# EAGLE design XMICRO-EXT (EAGLE 6.3)
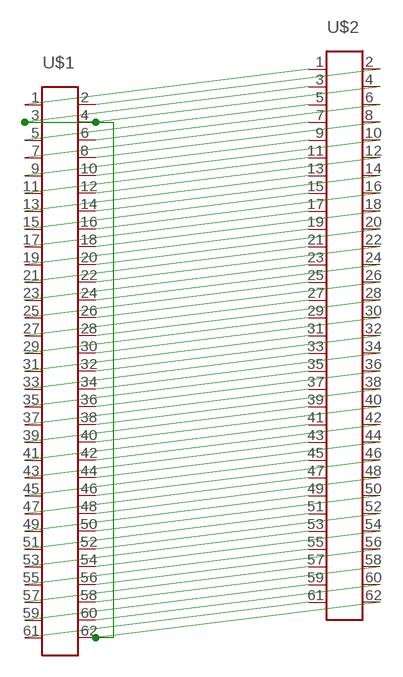
[diagram p0: schematic, sheet 1]

## Parts
U$1  EDGE62M  [EDGE62M]
U$2  EDGE62FR  [EDGE62FR]

## Nets
GND [GND]: U$1.3 U$1.4 U$1.62 U$2.3 U$2.4 U$2.62
N$1: U$1.1 U$2.1
N$2: U$1.2 U$2.2
N$5: U$1.5 U$2.5
N$6: U$1.6 U$2.6
N$7: U$1.7 U$2.7
N$8: U$1.8 U$2.8
N$9: U$1.9 U$2.9
N$10: U$1.10 U$2.10
N$11: U$1.11 U$2.11
N$12: U$1.12 U$2.12
N$13: U$1.13 U$2.13
N$14: U$1.14 U$2.14
N$15: U$1.15 U$2.15
N$16: U$1.16 U$2.16
N$17: U$1.17 U$2.17
N$18: U$1.18 U$2.18
N$19: U$1.19 U$2.19
N$20: U$1.20 U$2.20
N$21: U$1.21 U$2.21
N$22: U$1.22 U$2.22
N$23: U$1.23 U$2.23
N$24: U$1.24 U$2.24
N$25: U$1.25 U$2.25
N$26: U$1.26 U$2.26
N$27: U$1.27 U$2.27
N$28: U$1.28 U$2.28
N$29: U$1.29 U$2.29
N$30: U$1.30 U$2.30
N$31: U$1.31 U$2.31
N$32: U$1.32 U$2.32
N$33: U$1.33 U$2.33
N$34: U$1.34 U$2.34
N$35: U$1.35 U$2.35
N$36: U$1.36 U$2.36
N$37: U$1.37 U$2.37
N$38: U$1.38 U$2.38
N$39: U$1.39 U$2.39
N$40: U$1.40 U$2.40
N$41: U$1.41 U$2.41
N$42: U$1.42 U$2.42
N$43: U$1.43 U$2.43
N$44: U$1.44 U$2.44
N$45: U$1.45 U$2.45
N$46: U$1.46 U$2.46
N$47: U$1.47 U$2.47
N$48: U$1.48 U$2.48
N$49: U$1.49 U$2.49
N$50: U$1.50 U$2.50
N$51: U$1.51 U$2.51
N$52: U$1.52 U$2.52
N$53: U$1.53 U$2.53
N$54: U$1.54 U$2.54
N$55: U$1.55 U$2.55
N$56: U$1.56 U$2.56
N$57: U$1.57 U$2.57
N$58: U$1.58 U$2.58
N$59: U$1.59 U$2.59
N$60: U$1.60 U$2.60
N$61: U$1.61 U$2.61

## Library data of the parts
U$1 U$2 = Custom:EDGE62

## Net classes
1 GND: width 0.254 mm, clearance 0.508 mm

## Board
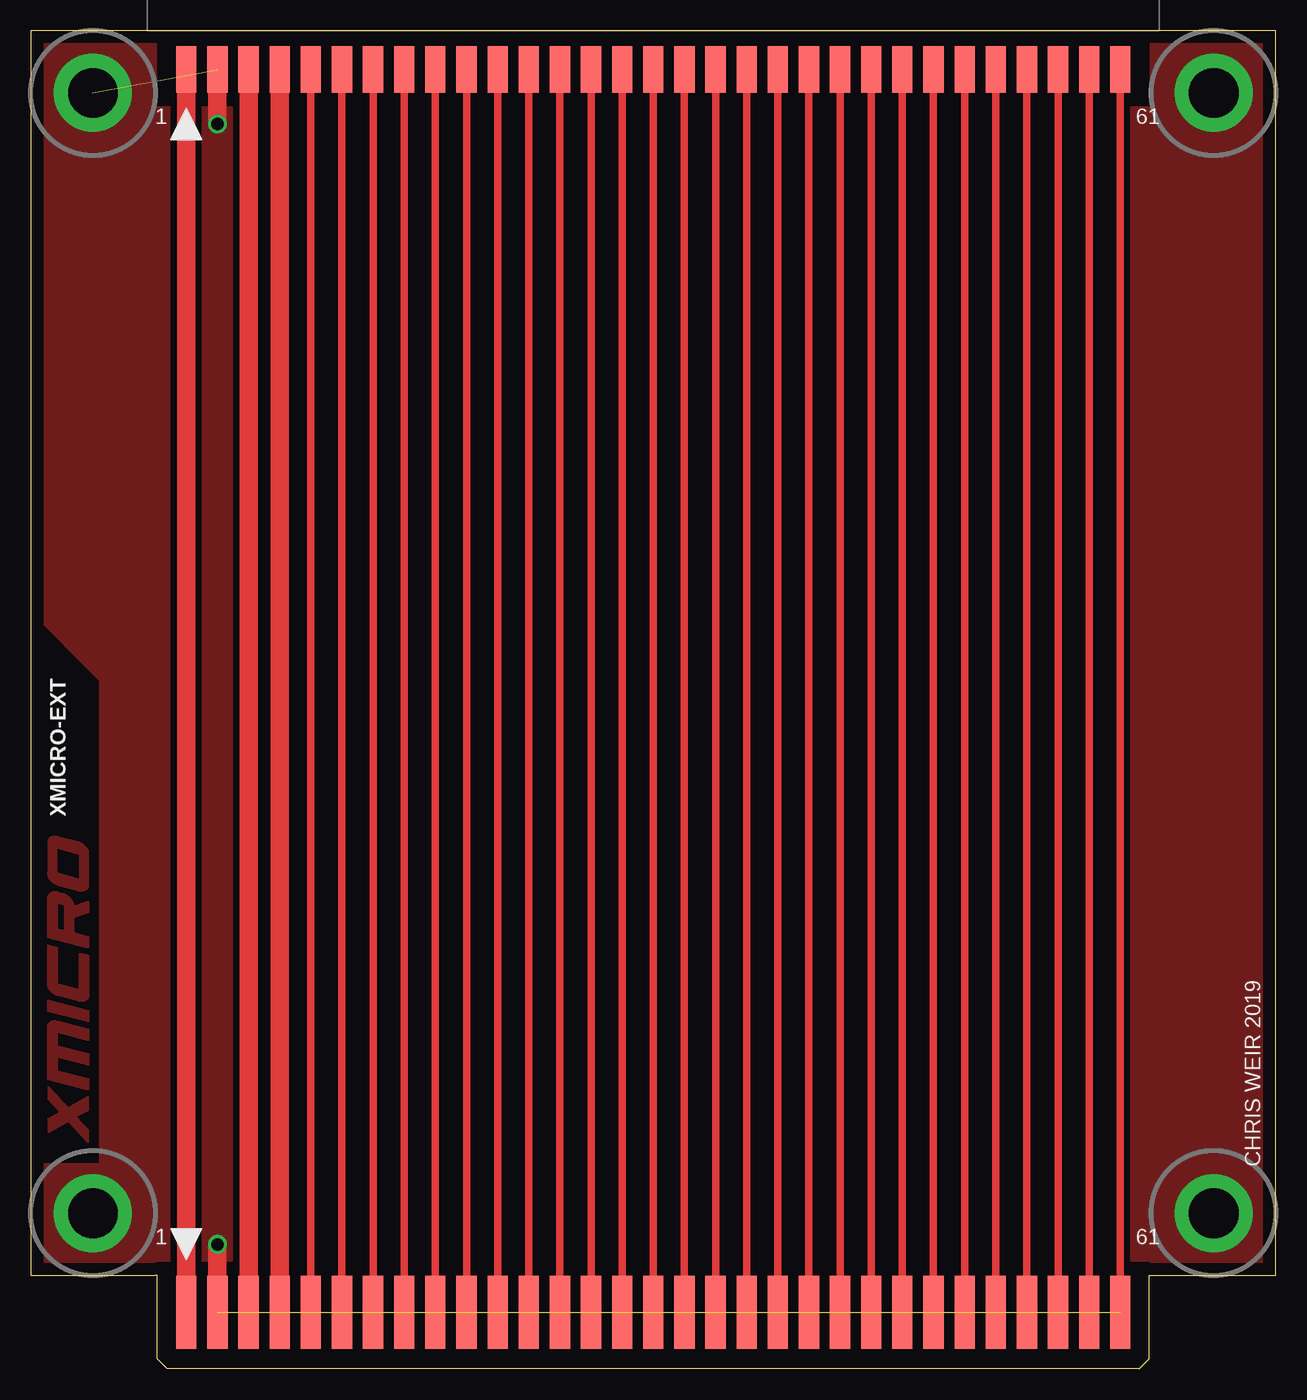
[diagram p1: board, top side]
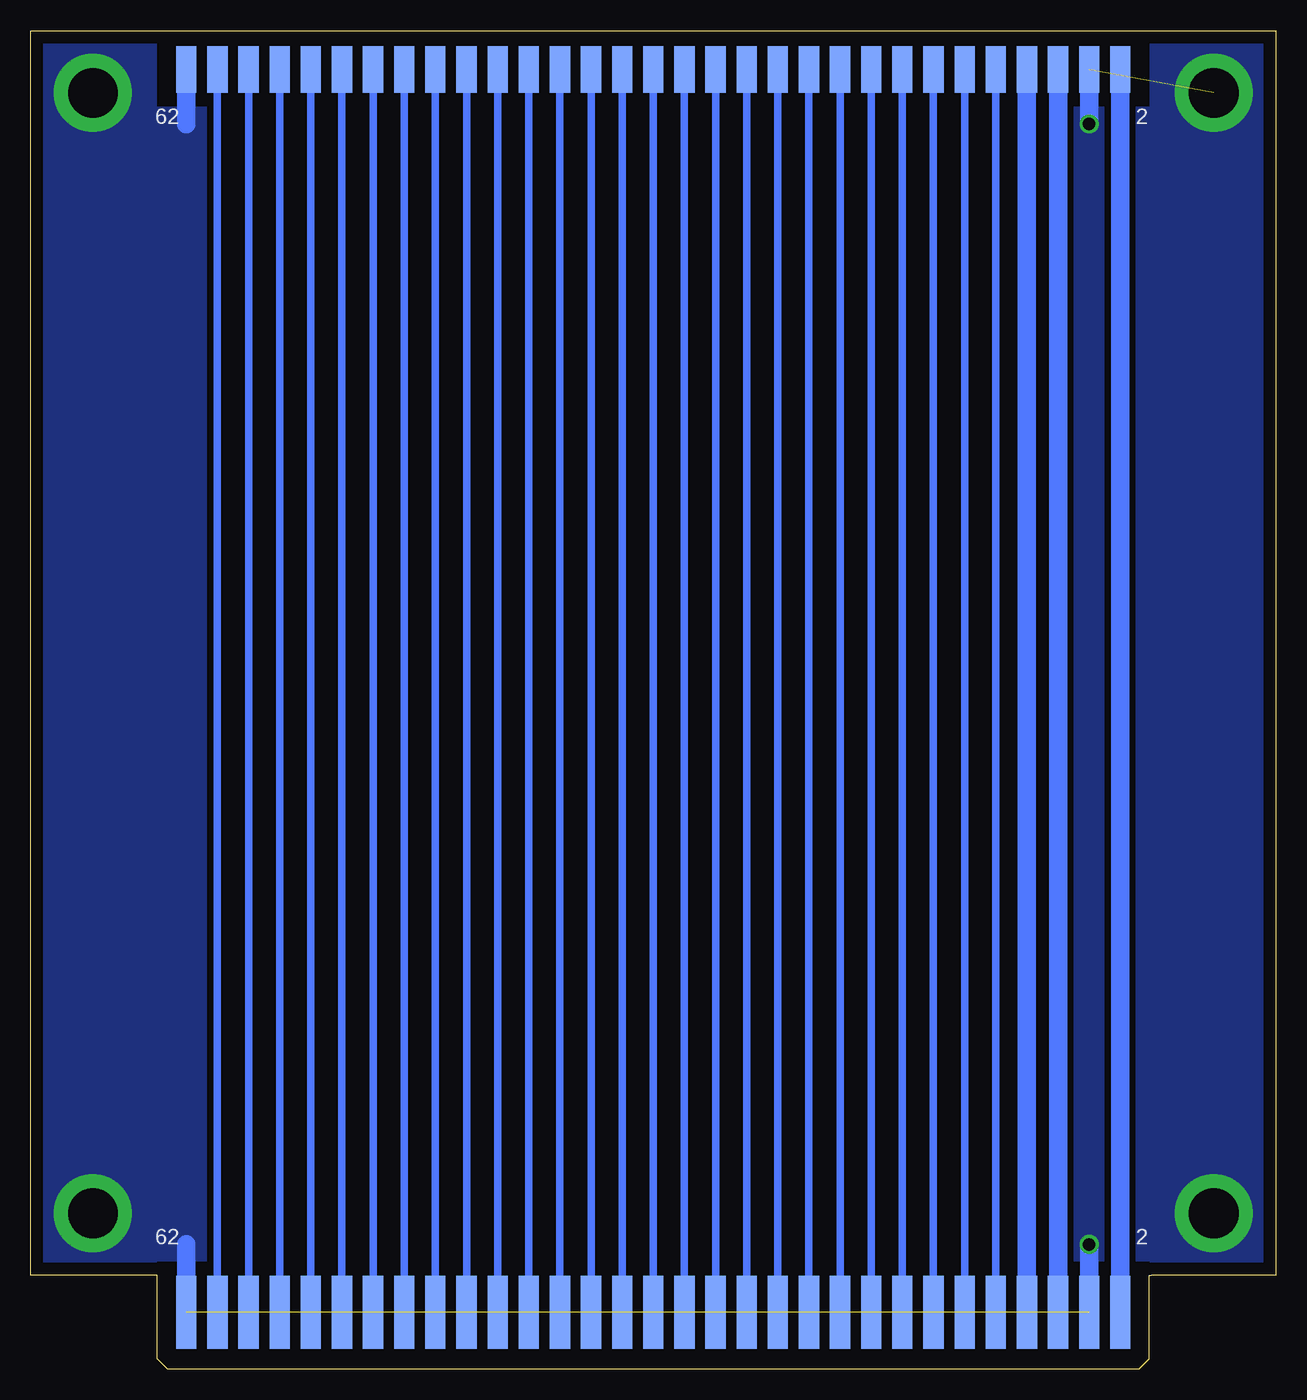
[diagram p2: board, bottom side, seen from below]

Size 101.6 x 109.22 mm. Coordinates in mm from the lower left corner, seen from the top.
Outline: 10.16,7.62 0,7.62 0,109.22 101.6,109.22 101.6,7.62 91.44,7.62
Copper layers (1*16): Top 0.035mm / dielectric 1.5mm / Bottom 0.035mm
Design rules "default *": minimum track width 10mil, minimum drill 0.3mm, track to track 10mil, track to pad 10mil, pad to pad 10mil, via to via 10mil, smd to smd 10mil, copper to edge 40mil, drill to drill 10mil, minimum pad ring 10mil, minimum via ring 8mil, stop-mask expansion 4mil, vias tented up to drill 25mil, thermal gap 10mil

### Footprints (pad centres in the part's own frame; a part is rotated, then mirrored left to right if it is on the bottom)
EDGE62M = smd 1.651 x 5.969: 1 -38.1,-3.01; 3 -35.56,-3.01; 5 -33.02,-3.01; 7 -30.48,-3.01; 9 -27.94,-3.01; 11 -25.4,-3.01; 13 -22.86,-3.01; 15 -20.32,-3.01; 17 -17.78,-3.01; 19 -15.24,-3.01; 21 -12.7,-3.01; 23 -10.16,-3.01; 25 -7.62,-3.01; 27 -5.08,-3.01; 29 -2.54,-3.01; 31 0,-3.01; 33 2.54,-3.01; 35 5.08,-3.01; 37 7.62,-3.01; 39 10.16,-3.01; 41 12.7,-3.01; 43 15.24,-3.01; 45 17.78,-3.01; 47 20.32,-3.01; 49 22.86,-3.01; 51 25.4,-3.01; 53 27.94,-3.01; 55 30.48,-3.01; 57 33.02,-3.01; 59 35.56,-3.01; 61 38.1,-3.01 | smd 1.651 x 5.969 bottom: 2 -38.1,-3.01; 4 -35.56,-3.01; 6 -33.02,-3.01; 8 -30.48,-3.01; 10 -27.94,-3.01; 12 -25.4,-3.01; 14 -22.86,-3.01; 16 -20.32,-3.01; 18 -17.78,-3.01; 20 -15.24,-3.01; 22 -12.7,-3.01; 24 -10.16,-3.01; 26 -7.62,-3.01; 28 -5.08,-3.01; 30 -2.54,-3.01; 32 0,-3.01; 34 2.54,-3.01; 36 5.08,-3.01; 38 7.62,-3.01; 40 10.16,-3.01; 42 12.7,-3.01; 44 15.24,-3.01; 46 17.78,-3.01; 48 20.32,-3.01; 50 22.86,-3.01; 52 25.4,-3.01; 54 27.94,-3.01; 56 30.48,-3.01; 58 33.02,-3.01; 60 35.56,-3.01; 62 38.1,-3.01
EDGE62FR = smd 1.651 x 3.81: 1 -38.1,-3.175; 3 -35.56,-3.175; 5 -33.02,-3.175; 7 -30.48,-3.175; 9 -27.94,-3.175; 11 -25.4,-3.175; 13 -22.86,-3.175; 15 -20.32,-3.175; 17 -17.78,-3.175; 19 -15.24,-3.175; 21 -12.7,-3.175; 23 -10.16,-3.175; 25 -7.62,-3.175; 27 -5.08,-3.175; 29 -2.54,-3.175; 31 0,-3.175; 33 2.54,-3.175; 35 5.08,-3.175; 37 7.62,-3.175; 39 10.16,-3.175; 41 12.7,-3.175; 43 15.24,-3.175; 45 17.78,-3.175; 47 20.32,-3.175; 49 22.86,-3.175; 51 25.4,-3.175; 53 27.94,-3.175; 55 30.48,-3.175; 57 33.02,-3.175; 59 35.56,-3.175; 61 38.1,-3.175 | smd 1.651 x 3.81 bottom: 2 -38.1,-3.175; 4 -35.56,-3.175; 6 -33.02,-3.175; 8 -30.48,-3.175; 10 -27.94,-3.175; 12 -25.4,-3.175; 14 -22.86,-3.175; 16 -20.32,-3.175; 18 -17.78,-3.175; 20 -15.24,-3.175; 22 -12.7,-3.175; 24 -10.16,-3.175; 26 -7.62,-3.175; 28 -5.08,-3.175; 30 -2.54,-3.175; 32 0,-3.175; 34 2.54,-3.175; 36 5.08,-3.175; 38 7.62,-3.175; 40 10.16,-3.175; 42 12.7,-3.175; 44 15.24,-3.175; 46 17.78,-3.175; 48 20.32,-3.175; 50 22.86,-3.175; 52 25.4,-3.175; 54 27.94,-3.175; 56 30.48,-3.175; 58 33.02,-3.175; 60 35.56,-3.175; 62 38.1,-3.175

### Placement (x,y rotation side)
U$1  50.8,7.62 0 top
U$2  50.8,109.22 0 top

### Tracks (layer width: path | path; a pad name or v marks a point on that pad's centre or on a via)
GND  (via drill 1.02, 4.06 pad 6.35)  (2 unrouted)
  Top 1.524: U$1.4 v15.24,10.16 | U$2.4 v15.24,101.6
  Bottom 1.524: U$1.4 v15.24,10.16 | U$1.62 88.9,10.16 | U$2.4 v15.24,101.6 | U$2.62 88.9,101.6
  other vias: 5.08,12.7 5.08,104.14 96.52,104.14 96.52,12.7
  pour Bottom: 91.44,7.62 101.6,7.62 101.6,109.22 91.44,109.22 91.44,102.87 10.16,102.87 10.16,109.22 0,109.22 0,7.62 10.16,7.62 10.16,8.89 91.44,8.89
  pour Top: 0,7.62 0,16.64 5.71,16.64 5.71,56.2 0,61.91 0,109.22 10.16,109.22 10.16,102.87 91.44,102.87 91.44,109.22 101.6,109.22 101.6,7.62 91.44,7.62 91.44,8.89 10.16,8.89 10.16,7.62
N$1
  Top 1.524: U$1.1 U$2.1
N$2
  Bottom 1.524: U$1.2 U$2.2
N$5
  Top 1.524: U$1.5 U$2.5
N$6
  Bottom 1.524: U$1.6 U$2.6
N$7
  Top 1.524: U$1.7 U$2.7
N$8
  Bottom 1.524: U$1.8 U$2.8
N$9
  Top 0.61: U$1.9 U$2.9
N$10
  Bottom 0.61: U$1.10 U$2.10
N$11
  Top 0.61: U$1.11 U$2.11
N$12
  Bottom 0.61: U$1.12 U$2.12
N$13
  Top 0.61: U$1.13 U$2.13
N$14
  Bottom 0.61: U$1.14 U$2.14
N$15
  Top 0.61: U$1.15 U$2.15
N$16
  Bottom 0.61: U$1.16 U$2.16
N$17
  Top 0.61: U$1.17 U$2.17
N$18
  Bottom 0.61: U$1.18 U$2.18
N$19
  Top 0.61: U$1.19 U$2.19
N$20
  Bottom 0.61: U$1.20 U$2.20
N$21
  Top 0.61: U$1.21 U$2.21
N$22
  Bottom 0.61: U$1.22 U$2.22
N$23
  Top 0.61: U$1.23 U$2.23
N$24
  Bottom 0.61: U$1.24 U$2.24
N$25
  Top 0.61: U$1.25 U$2.25
N$26
  Bottom 0.61: U$1.26 U$2.26
N$27
  Top 0.61: U$1.27 U$2.27
N$28
  Bottom 0.61: U$1.28 U$2.28
N$29
  Top 0.61: U$1.29 U$2.29
N$30
  Bottom 0.61: U$1.30 U$2.30
N$31
  Top 0.61: U$1.31 U$2.31
N$32
  Bottom 0.61: U$1.32 U$2.32
N$33
  Top 0.61: U$1.33 U$2.33
N$34
  Bottom 0.61: U$1.34 U$2.34
N$35
  Top 0.61: U$1.35 U$2.35
N$36
  Bottom 0.61: U$1.36 U$2.36
N$37
  Top 0.61: U$1.37 U$2.37
N$38
  Bottom 0.61: U$1.38 U$2.38
N$39
  Top 0.61: U$1.39 U$2.39
N$40
  Bottom 0.61: U$1.40 U$2.40
N$41
  Top 0.61: U$1.41 U$2.41
N$42
  Bottom 0.61: U$1.42 U$2.42
N$43
  Top 0.61: U$1.43 U$2.43
N$44
  Bottom 0.61: U$1.44 U$2.44
N$45
  Top 0.61: U$1.45 U$2.45
N$46
  Bottom 0.61: U$1.46 U$2.46
N$47
  Top 0.61: U$1.47 U$2.47
N$48
  Bottom 0.61: U$1.48 U$2.48
N$49
  Top 0.61: U$1.49 U$2.49
N$50
  Bottom 0.61: U$1.50 U$2.50
N$51
  Top 0.61: U$1.51 U$2.51
N$52
  Bottom 0.61: U$1.52 U$2.52
N$53
  Top 0.61: U$1.53 U$2.53
N$54
  Bottom 0.61: U$1.54 U$2.54
N$55
  Top 0.61: U$1.55 U$2.55
N$56
  Bottom 0.61: U$1.56 U$2.56
N$57
  Top 0.61: U$1.57 U$2.57
N$58
  Bottom 0.61: U$1.58 U$2.58
N$59
  Top 0.61: U$1.59 U$2.59
N$60
  Bottom 0.61: U$1.60 U$2.60
N$61
  Top 0.61: U$1.61 U$2.61
S$1
  pour Top: 4.69,18.49 4.69,19.48 3.66,20.59 4.69,21.15 4.69,22.2 3.06,21.25 1.43,23.03 1.43,22.05 2.47,20.92 1.43,20.36 1.43,19.32 3.09,20.26
  pour Top: 1.43,29.18 1.43,30.06 4.69,29.22 4.69,28.34
  pour Top: 1.43,34.57 2.12,34.4 2.12,31.41 4,30.93 4,33.9 4.69,33.74 4.69,30.45 arc-47 4.58,30.18 arc-36 4.26,30.04 arc-17 4,30.05 arc-5 3.85,30.08 2.27,30.48 arc-33 1.67,30.85 arc-31 1.44,31.23 arc-13 1.43,31.37
  pour Top: 1.43,35.22 2.12,35.92 2.83,35.74 2.83,37.85 2.12,38.03 2.12,35.94 1.43,35.24 1.43,38.37 arc-55 1.64,38.79 arc-31 1.9,38.9 arc-18 2.22,38.87 2.64,38.76 arc-18 2.82,38.68 arc-18 3.22,38.37 arc-19 3.42,38.06 arc-14 3.48,37.71 4.69,38.14 4.69,37.27 3.47,36.83 3.47,35.56 4.69,35.24 4.69,34.37
  pour Top: 4.69,22.79 1.43,23.63 1.43,27.91 arc-50 1.56,28.24 arc-37 1.85,28.37 arc-17 2.23,28.34 4.69,27.7 4.69,26.83 2.12,27.5 2.12,26.36 4.69,25.69 4.69,24.81 2.12,25.48 2.12,24.34 4.69,23.67
  pour Top: 2.12,40.45 2.12,42.54 4,42.04 4,39.92 2.12,40.42 1.43,40.47 1.43,40.37 arc33 1.57,39.98 arc19 1.89,39.69 arc18 2.27,39.51 3.87,39.09 arc9 3.97,39.07 arc9 4.21,39.06 arc22 4.42,39.1 arc36 4.6,39.23 arc17 4.67,39.35 arc13 4.69,39.49 4.69,42.07 arc18 4.67,42.28 arc16 4.57,42.46 arc14 4.35,42.7 arc26 3.88,42.95 2.21,43.39 arc17 1.93,43.41 arc19 1.71,43.37 arc66 1.43,42.99 1.43,40.5

### Text on the board
tPlace: CHRIS WEIR 2019
tNames: XMICRO-EXT
tValues: V1 1943